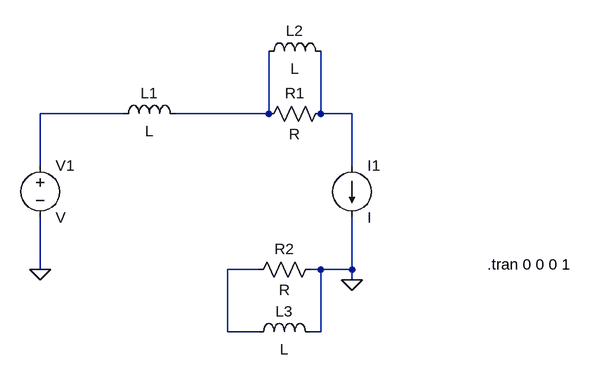
[diagram p0: schematic netlist_creation.asc]
netlist_creation.asc, the LTspice schematic file:
Version 4
SHEET 1 956 680
WIRE 256 176 128 176
WIRE 480 176 480 80
WIRE 480 176 336 176
WIRE 560 176 560 80
WIRE 608 176 560 176
WIRE 128 256 128 176
WIRE 608 256 608 176
WIRE 128 416 128 336
WIRE 464 416 416 416
WIRE 560 416 544 416
WIRE 608 416 608 336
WIRE 608 416 560 416
WIRE 608 432 608 416
WIRE 416 512 416 416
WIRE 464 512 416 512
WIRE 560 512 560 416
WIRE 560 512 544 512
FLAG 128 416 0
FLAG 608 432 0
SYMBOL voltage 128 240 R0
SYMATTR InstName V1
SYMBOL current 608 256 R0
SYMATTR InstName I1
SYMBOL res 576 160 R90
WINDOW 0 0 56 VBottom 2
WINDOW 3 32 56 VTop 2
SYMATTR InstName R1
SYMBOL res 560 400 R90
WINDOW 0 0 56 VBottom 2
WINDOW 3 32 56 VTop 2
SYMATTR InstName R2
SYMBOL ind 240 192 R270
WINDOW 0 32 56 VTop 2
WINDOW 3 5 56 VBottom 2
SYMATTR InstName L1
SYMBOL ind 464 96 R270
WINDOW 0 32 56 VTop 2
WINDOW 3 5 56 VBottom 2
SYMATTR InstName L2
SYMBOL ind 448 528 R270
WINDOW 0 32 56 VTop 2
WINDOW 3 5 56 VBottom 2
SYMATTR InstName L3
TEXT 816 408 Left 2 !.tran 0 0 0 1

The netlist it stands for:
* netlist_creation.asc
V1 N001 0 V
I1 N003 0 I
R1 N003 N002 R
R2 0 N004 R
L1 N001 N002 L
L2 N002 N003 L
L3 N004 0 L
.tran 0 0 0 1
.backanno
.end